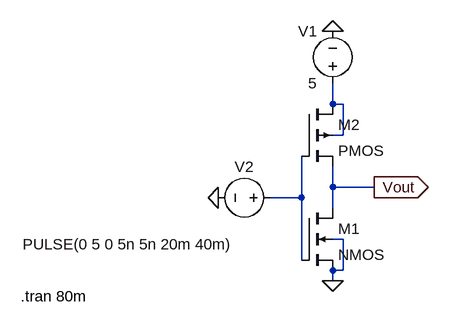
[diagram p0: schematic CMOS inverter.asc]
CMOS inverter.asc, the LTspice schematic file:
Version 4
SHEET 1 880 680
WIRE 192 48 192 16
WIRE 208 48 192 48
WIRE 208 96 208 48
WIRE 208 96 192 96
WIRE 192 176 192 144
WIRE 256 176 192 176
WIRE 144 192 144 128
WIRE 144 192 96 192
WIRE 192 208 192 176
WIRE 208 256 192 256
WIRE 144 288 144 192
WIRE 208 304 208 256
WIRE 208 304 192 304
WIRE 192 320 192 304
FLAG 192 320 0
FLAG 192 -64 0
FLAG 16 192 0
FLAG 256 176 Vout
IOPIN 256 176 Out
SYMBOL nmos4 144 208 R0
SYMATTR InstName M1
SYMBOL pmos4 144 48 R0
SYMATTR InstName M2
SYMBOL voltage 192 32 R180
WINDOW 0 24 96 Left 2
WINDOW 3 24 16 Left 2
WINDOW 123 0 0 Left 0
WINDOW 39 0 0 Left 0
SYMATTR InstName V1
SYMATTR Value 5
SYMBOL voltage 112 192 R90
WINDOW 0 -32 56 VBottom 2
WINDOW 3 56 235 VTop 2
WINDOW 123 0 0 Left 0
WINDOW 39 0 0 Left 0
SYMATTR InstName V2
SYMATTR Value PULSE(0 5 0 5n 5n 20m 40m)
TEXT -288 344 Left 2 !.tran 80m

The netlist it stands for:
* CMOS inverter.asc
M1 Vout N002 0 0 NMOS
M2 N001 N002 Vout N001 PMOS
V1 N001 0 5
V2 N002 0 PULSE(0 5 0 5n 5n 20m 40m)
.model NMOS NMOS
.model PMOS PMOS
.lib standard.mos
.tran 80m
.backanno
.end